# EAGLE design bancada_hx711_5 (EAGLE 8.6.0)
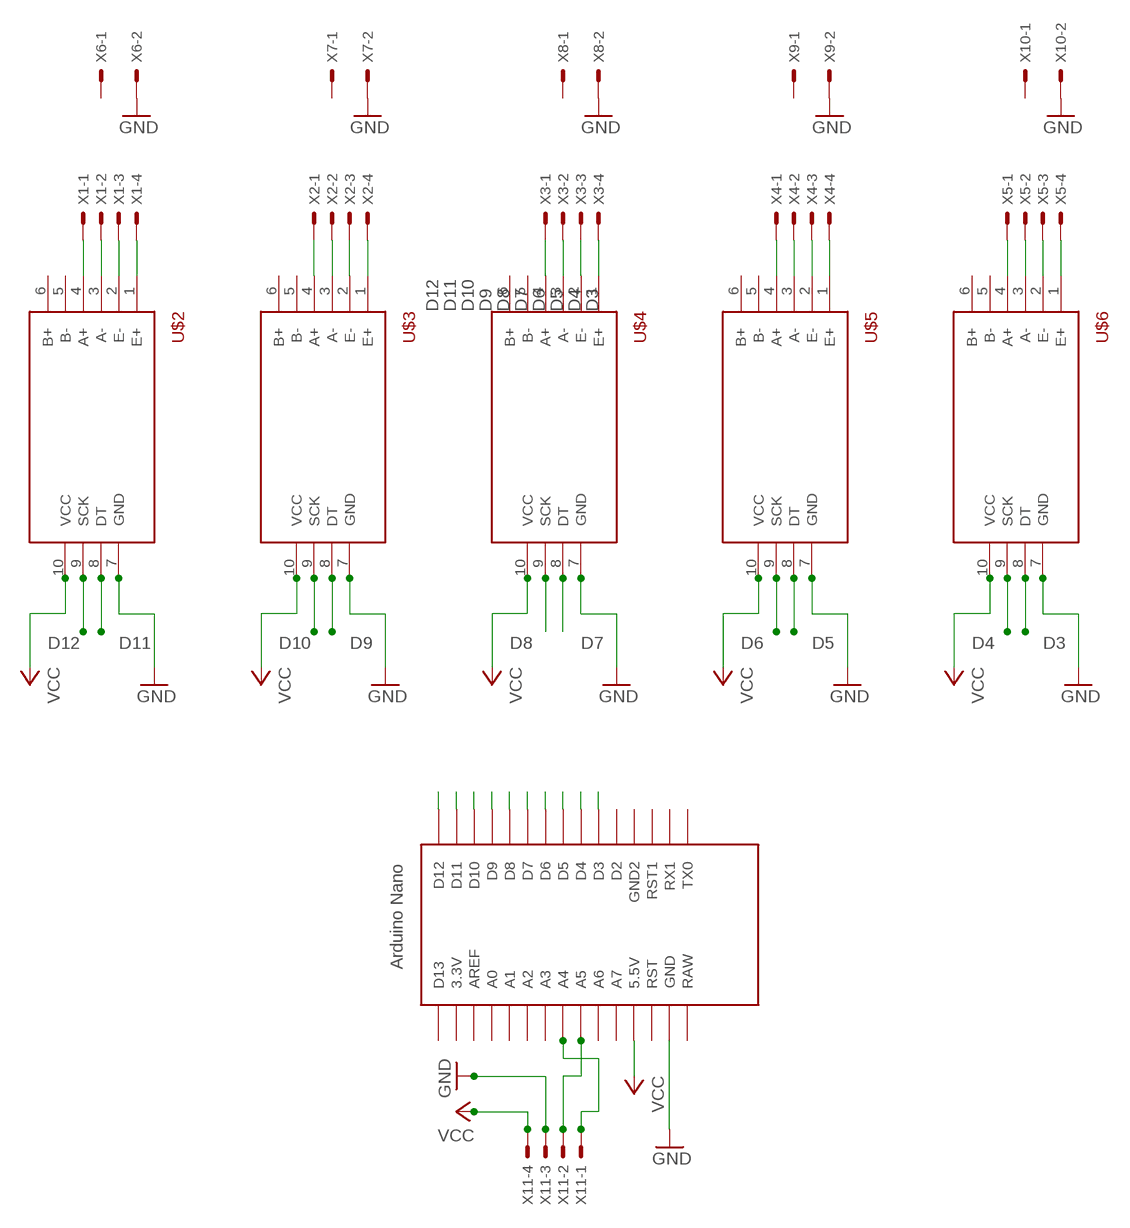
[diagram p0: schematic, sheet 1]

## Parts
U$1  NANO  [NANO]
U$2  HX711-1  [HX711-1]
U$3  HX711-1  [HX711-1]
U$4  HX711-1  [HX711-1]
U$5  HX711-1  [HX711-1]
U$6  HX711-1  [HX711-1]
X1  KK-156-4  [KK-156-4]
X2  KK-156-4  [KK-156-4]
X3  KK-156-4  [KK-156-4]
X4  KK-156-4  [KK-156-4]
X5  KK-156-4  [KK-156-4]
X6  KK-156-2  [KK-156-2]
X7  KK-156-2  [KK-156-2]
X8  KK-156-2  [KK-156-2]
X9  KK-156-2  [KK-156-2]
X10  KK-156-2  [KK-156-2]
X11  KK-156-4  [KK-156-4]

## Nets
D3: U$1.D3 U$6.8(DT)
D4: U$1.D4 U$6.9(SCK)
D5: U$1.D5 U$5.8(DT)
D6: U$1.D6 U$5.9(SCK)
D7: U$1.D7 U$4.8(DT)
D8: U$1.D8 U$4.9(SCK)
D9: U$1.D9 U$3.8(DT)
D10: U$1.D10 U$3.9(SCK)
D11: U$1.D11 U$2.8(DT)
D12: U$1.D12 U$2.9(SCK)
GND: U$1.GND U$2.7(GND) U$3.7(GND) U$4.7(GND) U$5.7(GND) U$6.7(GND) X6.2 X7.2 X8.2 X9.2 X10.2 X11.3
N$1: U$2.1(E+) X1.4
N$2: U$2.2(E-) X1.3
N$3: U$2.3(A-) X1.2
N$4: U$2.4(A+) X1.1
N$5: U$3.4(A+) X2.1
N$6: U$3.3(A-) X2.2
N$7: U$3.2(E-) X2.3
N$8: U$3.1(E+) X2.4
N$9: U$4.1(E+) X3.4
N$10: U$4.2(E-) X3.3
N$11: U$4.3(A-) X3.2
N$12: U$4.4(A+) X3.1
N$13: U$5.1(E+) X4.4
N$14: U$5.2(E-) X4.3
N$15: U$5.3(A-) X4.2
N$16: U$5.4(A+) X4.1
N$17: U$6.1(E+) X5.4
N$18: U$6.2(E-) X5.3
N$19: U$6.3(A-) X5.2
N$20: U$6.4(A+) X5.1
N$21: U$1.A5 X11.2
N$22: U$1.A4 X11.1
VCC: U$1.5V(5.5V) U$2.10(VCC) U$3.10(VCC) U$4.10(VCC) U$5.10(VCC) U$6.10(VCC) X11.4
Unconnected: U$1.3.3V U$1.A0 U$1.A1 U$1.A2 U$1.A3 U$1.A6 U$1.A7 U$1.AREF U$1.D2 U$1.D13 U$1.GND1(GND2) U$1.ICSP1 U$1.ICSP2 U$1.ICSP3 U$1.ICSP4 U$1.ICSP5 U$1.ICSP6 U$1.RAW U$1.RST U$1.RST1 U$1.RX1 U$1.TX0 U$2.5(B-) U$2.6(B+) U$3.5(B-) U$3.6(B+) U$4.5(B-) U$4.6(B+) U$5.5(B-) U$5.6(B+) U$6.5(B-) U$6.6(B+) X6.1 X7.1 X8.1 X9.1 X10.1

## Library data of the parts
U$1 = Arduino-clone:NANO: Arduino Nano
U$2-U$6 = HX711:HX711-1: Load cell amplifier board based on HX711
X1-X5 X11 = con-molex:KK-156-4: KK 156 HEADER Source: http://www.molex.com/pdm_docs/sd/026604100_sd.pdf; MF: MOLEX; OC_FARNELL: unknown; OC_NEWARK: unknown
X6-X10 = con-molex:KK-156-2: KK 156 HEADER Source: http://www.molex.com/pdm_docs/sd/026604100_sd.pdf; MF: MOLEX; OC_FARNELL: unknown; OC_NEWARK: unknown

## Net classes
0 default: clearance 0.205 mm

## Board
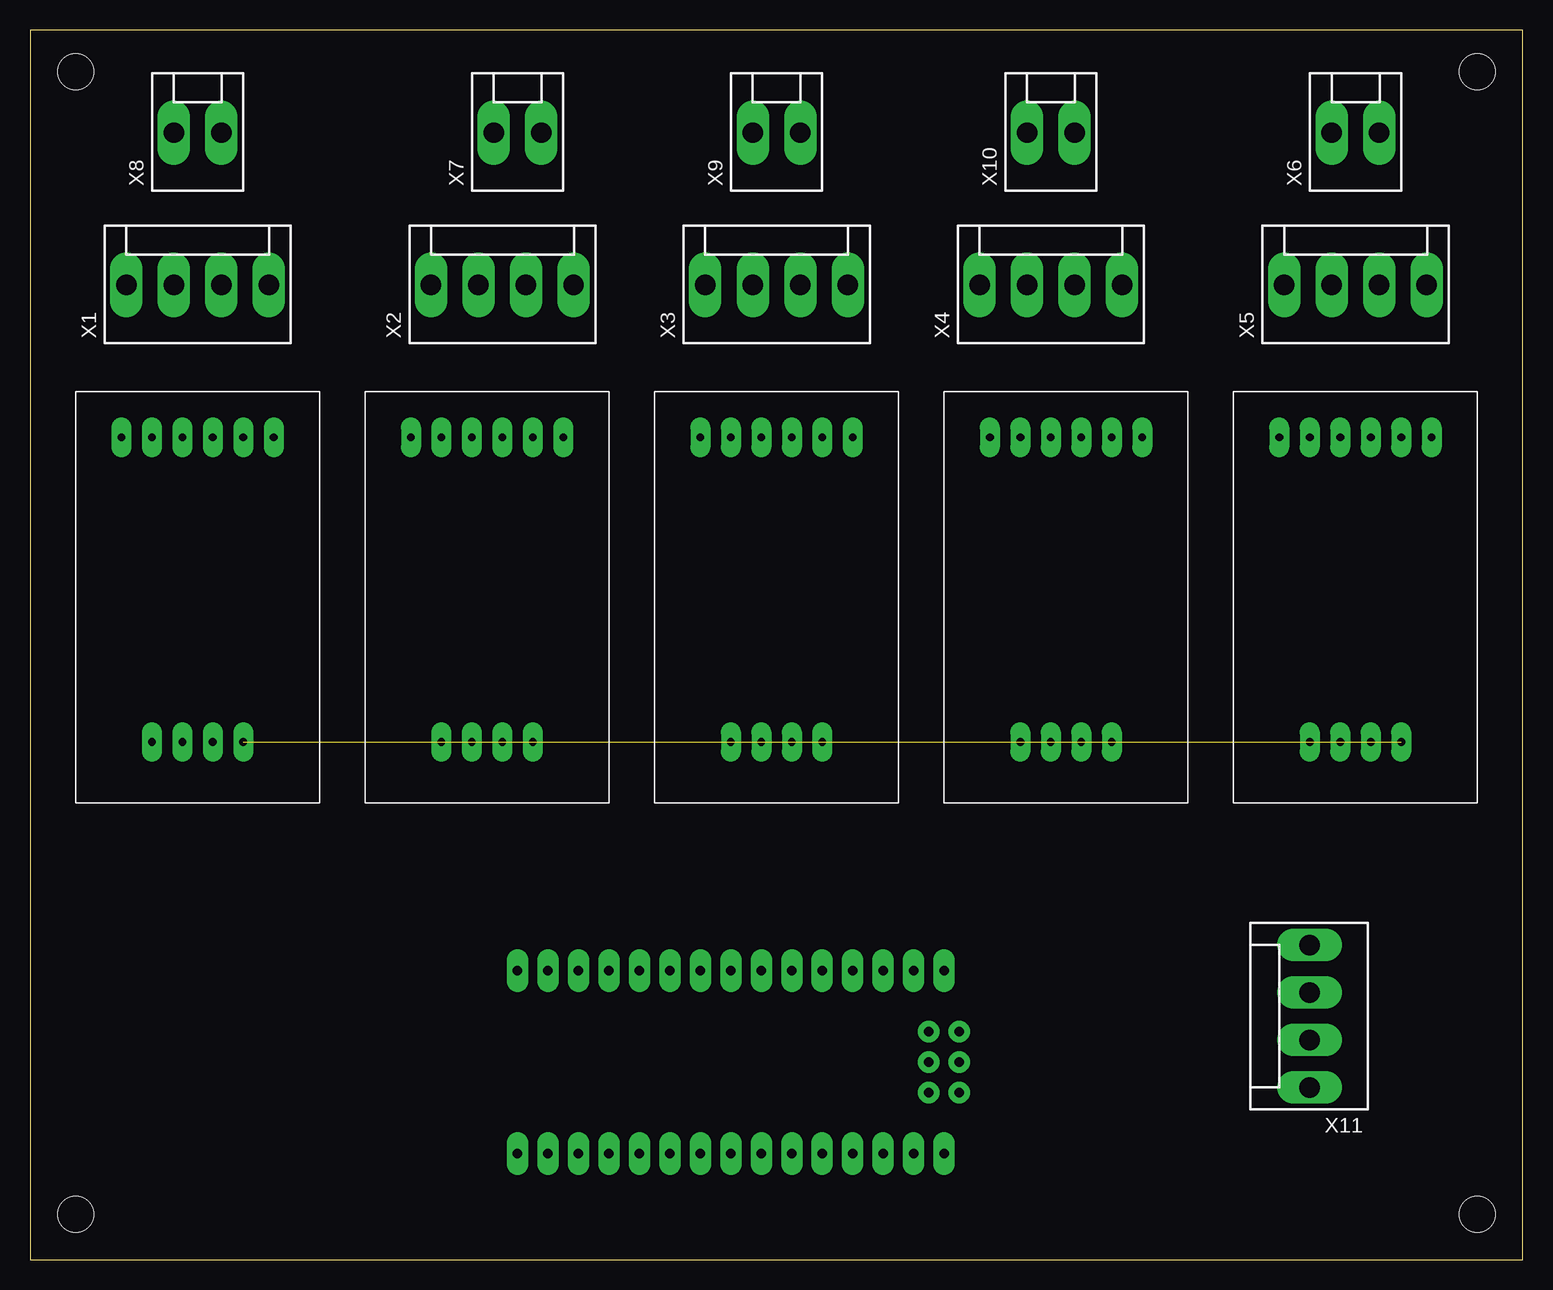
[diagram p1: board, top side]
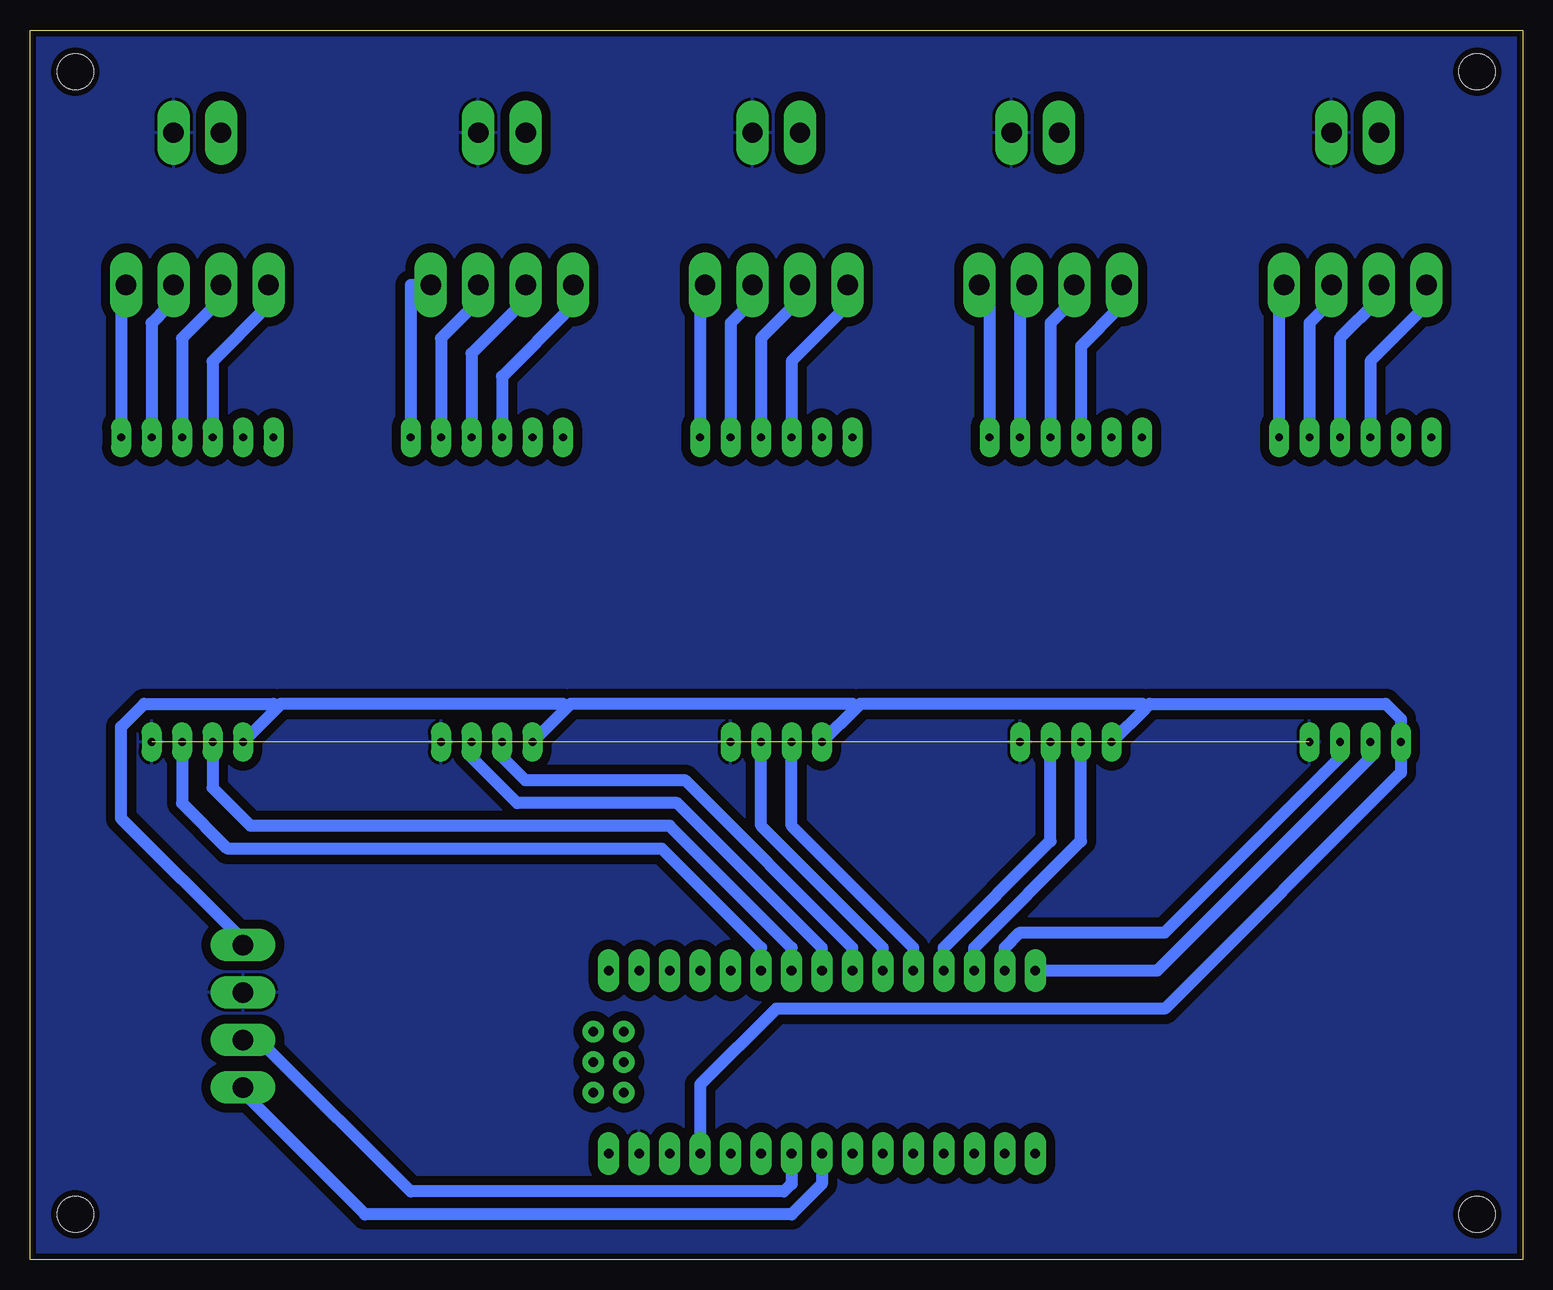
[diagram p2: board, bottom side, seen from below]

Size 124.44 x 102.54 mm. Coordinates in mm from the lower left corner, seen from the top.
Outline: 0,0 124.44,0 124.44,102.54 0,102.54 0,0
Copper layers (1*16): Top 0.035mm / dielectric 1.5mm / Bottom 0.035mm
Design rules "regraspcb2": minimum track width 1mm, minimum drill 1mm, track to track 30mil, track to pad 30mil, pad to pad 30mil, via to via 30mil, smd to smd 30mil, copper to edge 0.5mm, drill to drill 1.5mm, minimum pad ring 0.5mm, minimum via ring 0.5mm, stop-mask expansion 4mil, vias tented up to drill 0mil, thermal gap 10mil
Holes 3 mm at 3.81,3.81 120.65,3.81 120.65,99.06 3.81,99.06

### Footprints (pad centres in the part's own frame; a part is rotated, then mirrored left to right if it is on the bottom)
NANO = drill 0.8 long: 3.3V -10.16,24.13; 5V -10.16,-1.27; A0 -10.16,19.05; A1 -10.16,16.51; A2 -10.16,13.97; A3 -10.16,11.43; A4 -10.16,8.89; A5 -10.16,6.35; A6 -10.16,3.81; A7 -10.16,1.27; AREF -10.16,21.59; D2 5.08,1.27; D3 5.08,3.81; D4 5.08,6.35; D5 5.08,8.89; D6 5.08,11.43; D7 5.08,13.97; D8 5.08,16.51; D9 5.08,19.05; D10 5.08,21.59; D11 5.08,24.13; D12 5.08,26.67; D13 -10.16,26.67; GND -10.16,-6.35; GND1 5.08,-1.27; RAW -10.16,-8.89; RST -10.16,-3.81; RST1 5.08,-3.81; RX1 5.08,-6.35; TX0 5.08,-8.89 | drill 0.8: ICSP1 -5.08,-10.16; ICSP2 -5.08,-7.62; ICSP3 -2.54,-10.16; ICSP4 -2.54,-7.62; ICSP5 0,-10.16; ICSP6 0,-7.62
HX711-1 = drill 0.65 long: 1 3.81,16.51; 2 3.81,13.97; 3 3.81,11.43; 4 3.81,8.89; 5 3.81,6.35; 6 3.81,3.81; 7 29.21,13.97; 8 29.21,11.43; 9 29.21,8.89; 10 29.21,6.35
KK-156-4 = drill 1.7 pad 2.184 long: 1 -5.94,0; 2 -1.98,0; 3 1.98,0; 4 5.94,0
KK-156-2 = drill 1.7 pad 2.184 long: 1 -1.98,0; 2 1.98,0

### Placement (x,y rotation side)
U$1  67.31,19.05 90 top
U$2  3.81,72.39 270 top
U$3  27.94,72.39 270 top
U$4  52.07,72.39 270 top
U$5  76.2,72.39 270 top
U$6  100.33,72.39 270 top
X1  13.97,81.28 0 top
X2  39.37,81.28 0 top
X3  62.23,81.28 0 top
X4  85.09,81.28 0 top
X5  110.49,81.28 0 top
X6  110.49,93.98 0 top
X7  40.64,93.98 0 top
X8  13.97,93.98 0 top
X9  62.23,93.98 0 top
X10  85.09,93.98 0 top
X11  106.68,20.32 90 top

### Tracks (layer width: path | path; a pad name or v marks a point on that pad's centre or on a via)
D3
  Bottom 1: U$6.8 111.76,38.1 107.95,34.29 71.75,34.29 63.5,26.04 U$1.D3
D4
  Bottom 1: U$6.9 109.22,39.37 106.05,36.2 71.12,36.2 60.96,26.04 U$1.D4
D5
  Bottom 1: U$5.8 87.63,41.91 83.82,38.1 70.48,38.1 58.42,26.04 U$1.D5
D6
  Bottom 1: U$1.D6 55.88,26.04 69.85,40.01 83.15,40.01 85.09,41.94 U$5.9
D7
  Bottom 1: U$1.D7 53.34,26.04 63.5,36.2 U$4.8
D8
  Bottom 1: U$4.9 60.96,36.2 50.8,26.04 U$1.D8
D9
  Bottom 1: U$1.D9 48.26,26.04 39.37,34.92 U$3.8
D10
  Bottom 1: U$1.D10 45.72,26.04 36.83,34.92 U$3.9
D11
  Bottom 1: U$2.8 15.24,41.91 29.84,27.3 41.91,27.3 43.18,26.04 U$1.D11
D12
  Bottom 1: U$1.D12 30.48,24.13 12.7,41.91 U$2.9
GND  (4 unrouted)
  pour Bottom: -5.08,106.68 128.27,106.68 128.27,-2.54 -5.08,-2.54
N$1
  Bottom 1: U$2.1 20.32,81.28 X1.4
N$2
  Bottom 1: U$2.2 17.78,78.11 16.51,79.38 16.51,81.28 X1.3
N$3
  Bottom 1: U$2.3 15.24,76.83 12.06,80.01 12.06,81.28 X1.2
N$4
  Bottom 1: X1.1 8.26,81.28 8.26,79.38 12.7,74.93 U$2.4
N$5
  Bottom 1: X2.1 33.66,81.28 33.66,79.38 36.83,76.2 U$3.4
N$6
  Bottom 1: U$3.3 39.37,78.11 37.47,80.01 37.47,81.28 X2.2
N$7
  Bottom 1: U$3.2 41.91,81.28 X2.3
N$8
  Bottom 1: U$3.1 44.45,81.28 X2.4
N$9
  Bottom 1: U$4.1 68.58,81.28 X3.4
N$10
  Bottom 1: U$4.2 66.04,78.11 64.77,79.38 64.77,81.28 X3.3
N$11
  Bottom 1: U$4.3 63.5,76.83 60.33,80.01 60.33,81.28 X3.2
N$12
  Bottom 1: X3.1 56.52,81.28 56.52,79.38 60.96,74.93 U$4.4
N$13
  Bottom 1: U$5.1 92.71,81.28 X4.4
N$14
  Bottom 1: U$5.2 90.17,76.83 87.63,79.38 87.63,81.28 X4.3
N$15
  Bottom 1: X4.2 83.19,81.28 83.19,80.01 87.63,75.56 U$5.3
N$16
  Bottom 1: X4.1 79.38,81.28 79.38,79.38 85.09,73.66 U$5.4
N$17
  Bottom 1: U$6.1 116.84,81.28 X5.4
N$18
  Bottom 1: U$6.2 114.3,78.11 113.03,79.38 113.03,81.28 X5.3
N$19
  Bottom 1: U$6.3 111.76,76.83 108.58,80.01 108.58,81.28 X5.2
N$20
  Bottom 1: X5.1 104.78,81.28 104.78,79.38 109.22,74.93 U$6.4
N$21
  Bottom 1: U$1.A5 60.96,6.35 61.59,5.71 92.71,5.71 104.78,17.78 106.68,17.78 X11.2
N$22
  Bottom 1: U$1.A4 58.42,6.35 60.96,3.81 96.52,3.81 106.68,13.97 X11.1
VCC
  Bottom 1: U$3.10 31.43,46.04 | 31.43,46.04 31.11,46.35 11.43,46.35 10.16,45.09 U$2.10 10.16,40.64 29.84,20.95 62.23,20.95 68.58,14.61 U$1.5V | 55.56,46.04 55.24,46.35 31.75,46.35 31.43,46.04 | 55.56,46.04 U$4.10 | 79.69,46.04 79.38,46.35 55.88,46.35 55.56,46.04 | 79.69,46.04 U$5.10 | 103.82,46.04 103.5,46.35 80.01,46.35 79.69,46.04 | 103.82,46.04 U$6.10 | X11.4 106.68,26.67 116.84,36.83 116.84,44.45 114.94,46.35 104.14,46.35 103.82,46.04